# Altium schematic sheet CAN_Module.SchDoc
size A4; SheetNumber: 9; SheetTotal: 13
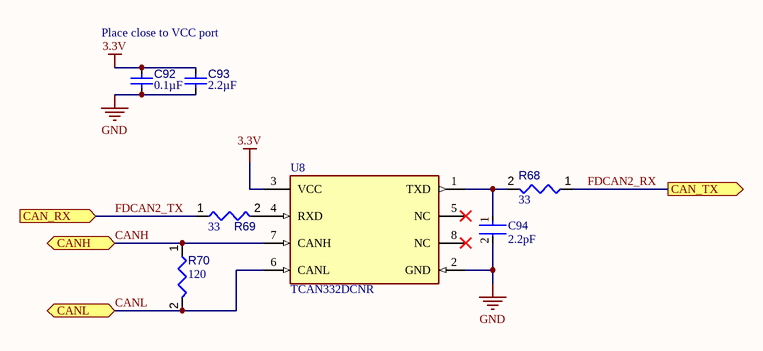
[diagram p0: CAN_Module.SchDoc]

## Parts
C92  value 0.1µF  [CAPC0603(1608)100_L]  (hidden comment: Capacitor 10µF +/-20% 10V 0603)
C93  value 2.2µF  [CAPC0603(1608)100_L]  (hidden comment: Capacitor 10µF +/-20% 10V 0603)
C94  2.2pF  [FP-C0603C-CF-MFG]
R68  value 33  [RESC1609X50X30ML08T20]  (hidden comment: Resistor 22R +/-1% 0603 100 mW)
R69  value 33  [RESC1609X50X30ML08T20]  (hidden comment: Resistor 22R +/-1% 0603 100 mW)
R70  value 120  [RESC1609X50X30ML08T20]  (hidden comment: Resistor 20R +/-1% 0603 100 mW)
U8  TCAN332DCNR  [FP-DCN0008A-IPC_A]

## Ports
CAN_RX (in), CAN_TX (out), CANH (bidir), CANL (bidir)

## Nets
3.3V: C92.1 C93.1 U8.3(VCC)
GND: C92.2 C93.2 C94.2 U8.2(GND)
CANH: R70.1 U8.7(CANH) ; port CANH
CANL: R70.2 U8.6(CANL) ; port CANL
FDCAN2_RX: R68.1 ; port CAN_TX
FDCAN2_TX: R69.1 ; port CAN_RX
NetC94_1: C94.1 R68.2 U8.1(TXD)
NetR69_2: R69.2 U8.4(RXD)

Not connected (* = marked no-connect by the designer): U8 5(NC)* 8(NC)*

## Notes on the sheet
- Place close to VCC port

## Library data of the parts
C92 C93 = CMP-001-00075-6: Chip Capacitor, 10µF +/-20%, 10V, 0603, Thickness 1 mm; Tolerance: 10%; Mounting Technology: SMT; Case/Package: 0603; Max Operating Temperature: 85°C; Voltage Rating: 10V; Pins: 2; Min Operating Temperature: -55°C
C94 = CMP-1035-00158-3: CAP CER 2.2PF 50V NP0 0603; Manufacturer Part Number: C0603C229C5GACTU; Manufacturer: KEMET; Automotive Grade: Grade 1; Temperature Coefficient: 30ppm/°C; Description: C0603 2.2 pF C0G 30ppm/°C 0.25 pF 50 V; Temperature Characteristic: C0G; Tolerance: 0.25 pF; Material: Ceramic; Lead Free: Yes; Value: 2.2 pF; Voltage Rating: 50 V; Package: C0603C-CF; Category: Cap; RoHS: TRUE; ComponentLink2Description: Datasheet; Capacitance: 2.2 pF; Device Class L2: Capacitors; Digikey Description: CAP CER 2.2PF 50V NP0 0603; Temperature: -55°C to +125°C; Temperature Range Low: -55°C; Mouser Description: Multilayer Ceramic Capacitors MLCC - SMD/SMT 50volts 2.2pF C0G 0.25%; ComponentLink2URL: https://api.kemet.com/component-edge/download/datasheet/C0603C100J5GACAUTO.pdf; Temperature Range High: +125°C; Height: 0.87mm; Automotive: Yes; Device Class L1: Passive Components; Octopart: https://octopart.com/c0603c229c5gactu-kemet-3874912; Device Class L3: Ceramic Capacitors
R68 R69 = CMP-009-00027-5: Chip Resistor, 22 Ohm, +/- 1%, 100 mW, -55 to 155 degC, 0603 (1608 Metric); Power: 100mW; Voltage Rating: 75V; Max Operating Temperature: 155°C; Min Operating Temperature: -55°C; Tolerance: 1%; RoHS Compliant: True; Mounting Technology: SM; Case/Package: 0603; Pins: 2
R70 = CMP-009-00199-1: Chip Resistor, 20 Ohm, +/- 1%, 100 mW, -55 to 155 degC, 0603 (1608 Metric); Power: 100mW; Voltage Rating: 75V; RoHS Compliant: True; Tolerance: 1%; Mounting Technology: SM; Min Operating Temperature: -55°C; Pins: 2; Max Operating Temperature: 155°C; Case/Package: 0603
U8 = CMP-04872-000203-1: IC TRANSCEIVER 1/1 SOT23-8; Receiver Hysteresis: 120mV; Packaging: Tape and Reel; Mount: Surface Mount; RoHS Compliant: Yes; Min Operating Temperature: -40°C; Case/Package: SOT-23-8; Lead Free: Lead Free; Max Operating Temperature: 125°C